# Altium schematic sheet Sheet3.SchDoc
size A4; SheetNumber: 3; SheetTotal: 3
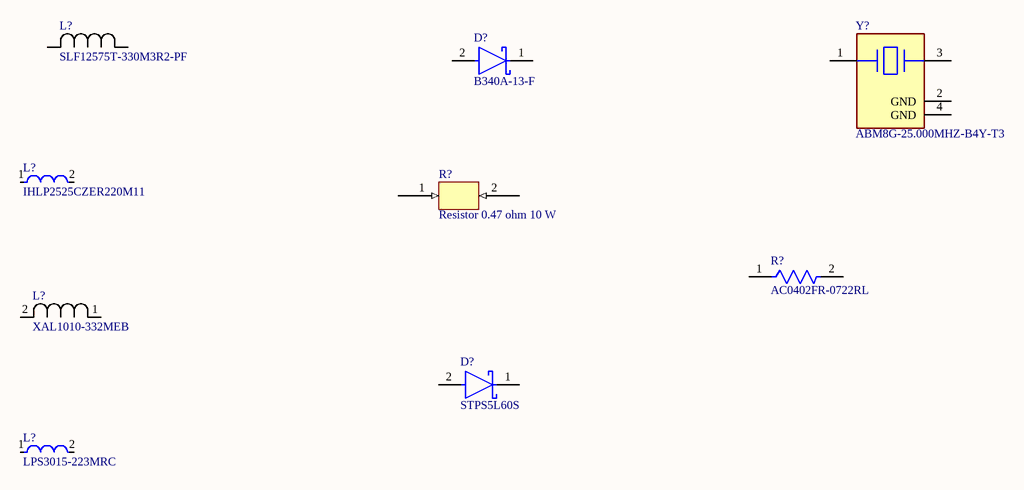
[diagram p0: Sheet3.SchDoc]

## Parts
(Parts that share a designator on the sheet are numbered #1, #2 ... from top to bottom, then left to right.)
D?#1  B340A-13-F  [FP-SMA-MFG]
D?#2  STPS5L60S  [DIOM6959X26N]
L?#1  SLF12575T-330M3R2-PF  [IND_12575_TDK]
L?#2  IHLP2525CZER220M11  [FP-IHLP-2525CZ-FP_2_413x3-MFG]
L?#3  XAL1010-332MEB  [XAL1010-332MEB-Footprint-1]
L?#4  LPS3015-223MRC  [FP-LPS3015-MFG]
R?#1  Resistor 0.47 ohm 10 W  [DIOMELF3516N]
R?#2  AC0402FR-0722RL  [FP-AC0402-IPC_A]
Y?  ABM8G-25.000MHZ-B4Y-T3  [FP-ABM8G-MFG]

## Nets

Not connected (* = marked no-connect by the designer): D?#1 1(C) 2(A); D?#2 1(C) 2(A); L?#1 1 2; L?#2 1 2; L?#3 1 2; L?#4 1 2; R?#1 1 2; R?#2 1 2; Y? 1 2(GND) 3 4(GND)

## Library data of the parts
D?#1 = CMP-003-00173-2: Rectifier Diode, Schottky, 1 Phase, 1 Element, 3A, 40V V(RRM), Silicon; Manufacturer: Diodes Incorporated; Max Operating Temperature: 125°C; LCSC Part #: C85098; Pins: 2; Manufact. No.: B340A-13-F; Min Operating Temperature: -55°C
D?#2 = CMP-003-00102-3: Rectifier Diode, Schottky, 1 Phase, 1 Element, 5A, 60V V(RRM), Silicon; Max Operating Temperature: 150°C; Pins: 2; LCSC Part #: C140620
L?#1 = CMP-006-00021-3: 3.2A 33uH ±20% 3.2A SMD,12.5x12.5mm Power Inductors ROHS; Mfr_Name: TDK; LCSC Part #: C87568; Source: SLF12575T-330M3R2-PF.SchLib; Component Type: Standard; Design Item ID: SLF12575T-330M3R2-PF; Manufacturer: TDK; Manufact. No.: SLF12575T-330M3R2-PF; Pins: 2
L?#2 = CMP-003-00045-1: General Purpose Inductor, 22uH, 20%, 1 Element, Composite-Core, SMD, 2525; Min Operating Temperature: -55°C; Pins: 2; Packaging: Tape and Reel; Tolerance: 20%; LCSC Part #: C845021; Max Operating Temperature: 125°C; Termination: Wraparound
L?#3 = CMP-003-00401-1: General Purpose Inductor, 3.3uH, 20%, 1 Element, Composite-Core, SMD, 4539; Packaging: Cut Tape; LCSC Part #: C43239891; Length: 11.8mm; Lead Free: Contains Lead; Tolerance: 20%; Termination: SMD/SMT; Min Operating Temperature: -40°C; Case/Package: SMD/SMT; Max Operating Temperature: 125°C; Width: 10mm; Height: 10mm
L?#4 = CMP-003-00235-1: General Purpose Inductor, 22uH, 20%, 1 Element, Ferrite-Core, SMD, 1212; Case/Package: 1212; Height: 1.4mm; Termination: SMD/SMT; Tolerance: 20%; Min Operating Temperature: -40°C; LCSC Part #: C5441602; Width: 2.95mm; Length: 3mm; Max Operating Temperature: 125°C
R?#1 = CMP-003-00201-1: otprilike nacrtan R, za dokumentaciju o MAGTROL-u
R?#2 = CMP-003-00333-1: Res Thick Film 0402 22 Ohm 1% 0.063W(1/16W) ±100ppm/C Pad SMD Automotive T/R; Width: 500µm; Tolerance: 1%; LCSC Part #: C226359; Max Operating Temperature: 155°C; Lead Free: Lead Free; Packaging: Tape & Reel; Termination: SMD/SMT; Case/Package: 0402; Length: 990.6µm; Min Operating Temperature: -55°C; Height: 320µm
Y? = CMP-003-00034-2: Crystal 25MHz ±30ppm (Tol) ±30ppm (Stability) 10pF FUND 60Ohm 4-Pin Ultra Mini-CSMD T/R; LCSC Part #: C596913